# Altium project RX_Amp_board_round2.PrjPcb
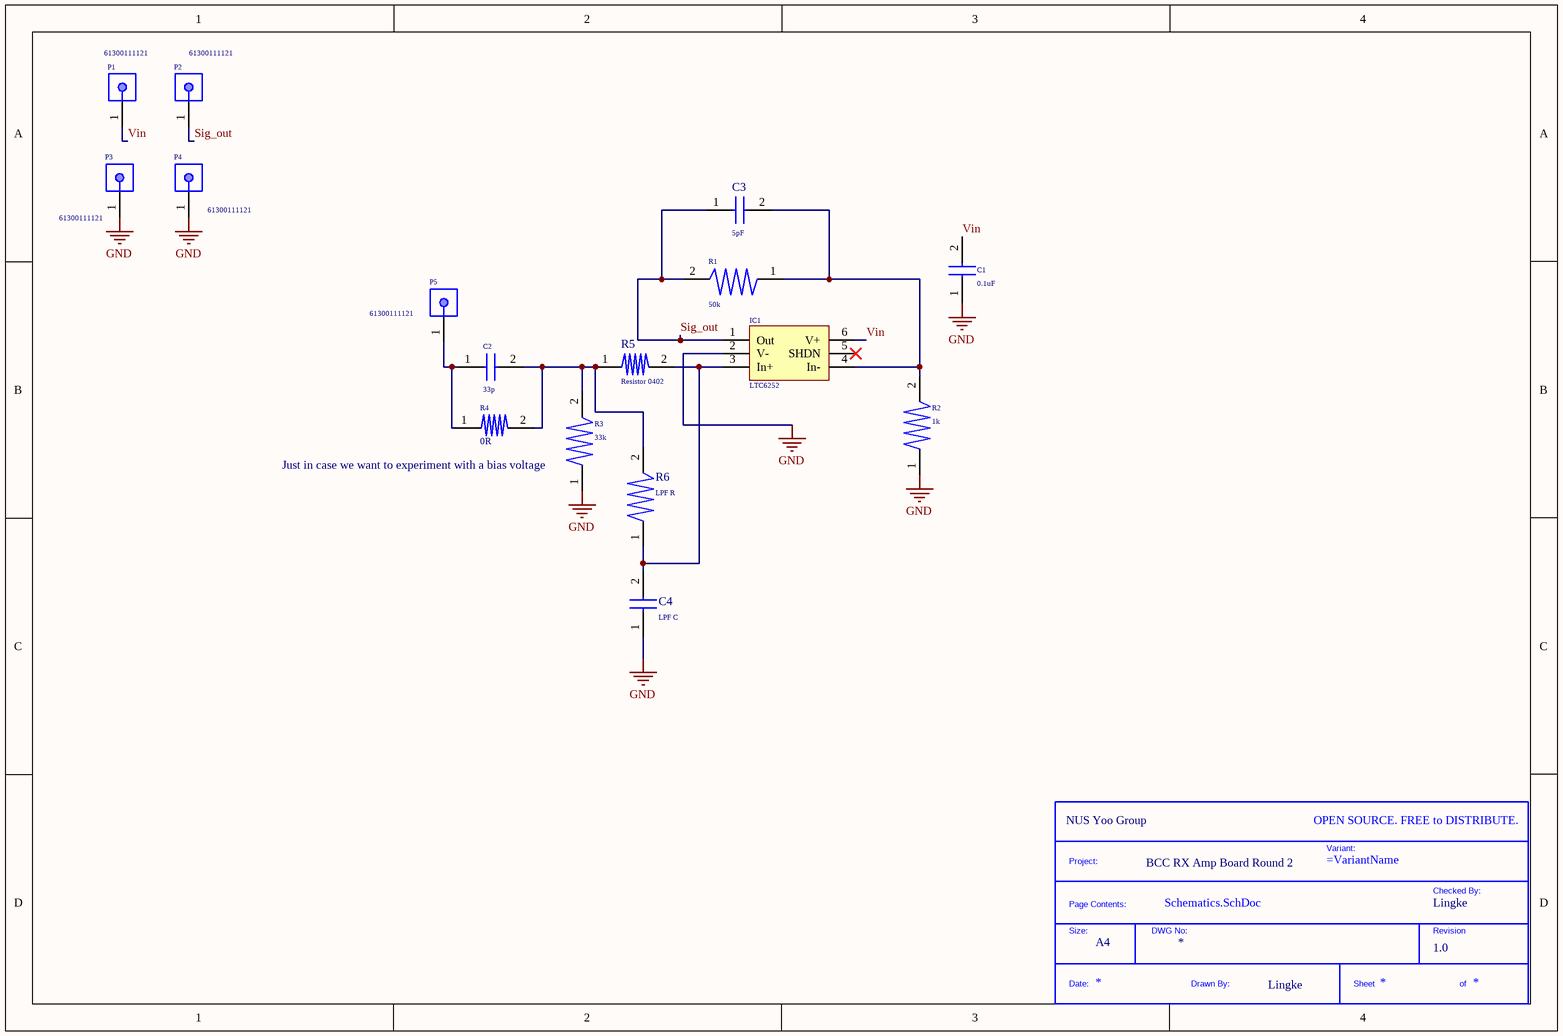
[diagram p0: Schematics.SchDoc]
1 sheet, 17 parts. Net scope: global (net labels, ports and power ports of the same name join across sheets).
Board file: Layout.PcbDoc

## Sheet Schematics.SchDoc
size A4

### Parts
*?  Project Name: BCC RX Amp Board Round 2  Company: NUS Yoo Group  Drawn By: Lingke  Revision: 1.0  Size: A4  (hidden comment: Title_Block)  (no BOM)
C1  0.1uF  [0603]
C2  33p  [0603]
C3  5pF  [0603]
C4  LPF C  [0603]
IC1  LTC6252  [SOT-23-6]
P1  61300111121  [61300111121]
P2  61300111121  [61300111121]
P3  61300111121  [61300111121]
P4  61300111121  [61300111121]
P5  61300111121  [61300111121]
R1  50k  [0603]
R2  1k  [0603]
R3  33k  [0603]
R4  0R  [0402]
R5  Resistor 0402  [0402]
R6  LPF R  [0603]

### Nets
GND: C1.1 C4.1 IC1.2(V-) P3.1 P4.1 R2.1 R3.1
Sig_out: C3.1 IC1.1(Out) P2.1 R1.2
Vin: C1.2 IC1.6(V+) P1.1
NetC2_1: C2.1 P5.1 R4.1
NetC2_2: C2.2 R3.2 R4.2 R5.1 R6.2
NetC3_2: C3.2 IC1.4(In-) R1.1 R2.2
NetC4_2: C4.2 IC1.3(In+) R5.2 R6.1

Not connected (* = marked no-connect by the designer): IC1 5(SHDN)*

### Notes on the sheet
- (near R3) Just in case we want to experiment with a bias voltage
- (in symbol Title_Block) OPEN SOURCE. FREE to DISTRIBUTE.; Variant:; Project:; Checked By:; Page Contents:; Size:; DWG No:; Revision; Date:; Drawn By:; Sheet; of

### Library data of the parts
*? = Title_Block: Standard Title Block.; DWG No: *; Checked By: Lingke
C1-C4 = Capacitor
P1-P5 = 61300111121: WR-PHD Pin Header, THT, pitch 2.54mm, Single Row, Vertical, 1p; Manufacturer: Wurth Elektronik; Pin Number: 1; Rated Current: 3A; Working Voltage: 250VAC; Withstanding Voltage: 500VAC; Contact Resistance: 20mOhm; ComponentLink1Description: Manufacturer; ComponentLink1URL: http://www.we-online.de; ComponentLink2Description: Datasheet; ComponentLink2URL: https://www.we-online.com/catalog/datasheet/61300111121.pdf; Manufacturer Part Number: 61300111121; Published Date: May 2020; Pitch: 2.54mm; Operating Temperature: -40 to +105degC; Mounting Technology: THT; Packaging: Bag; Gender: Pin Header; Row Number: Single; Orientation: Vertical
R1-R3 R6 = Resistor 0603: Resistor
R4 = Resistor 0402
IC1 = LTC6252: Supplier 1: Mouser; Supplier Part Number 1: 584-LTC6252CS6TRMPBF